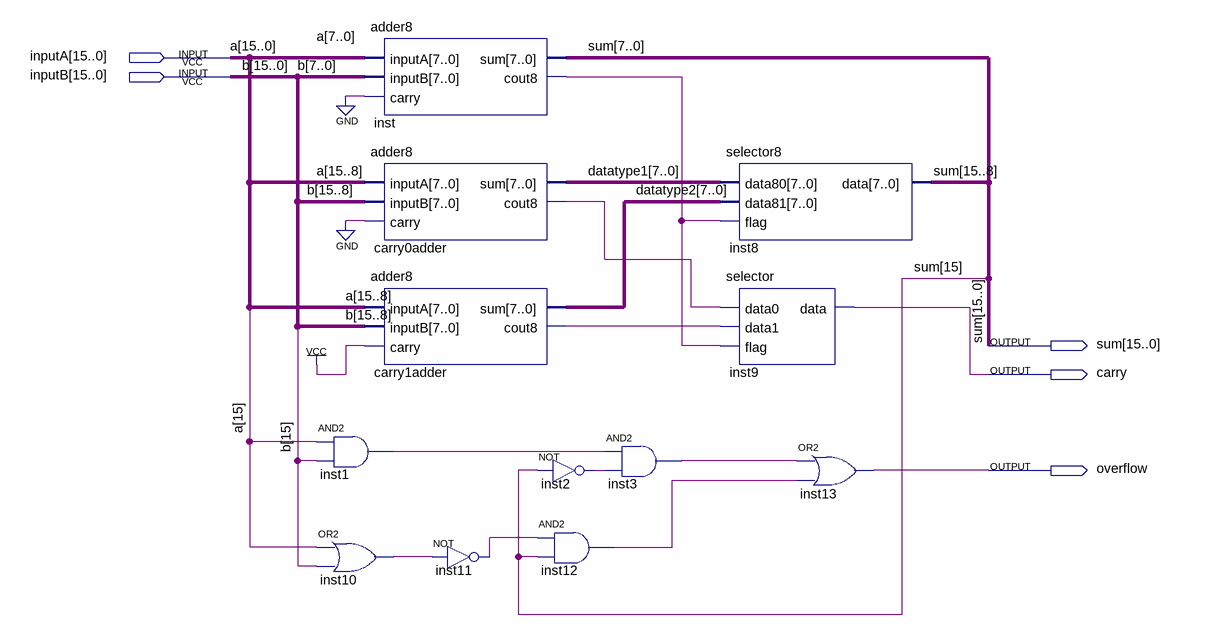
[diagram p0: schematic sheet]
// Quartus schematic adder16.bdf as structural Verilog: 12 symbols, 5 pins
module adder16 (
  input  [15:0] inputA,
  input  [15:0] inputB,
  output [15:0] sum,
  output carry,
  output overflow
);

  wire carry0adder_cout8, carry1adder_cout8, inst1_out, inst2_out, inst3_out, inst10_out, inst11_out,
       inst12_out, inst_cout8;
  wire [7:0] datatype1, datatype2;

  and inst1 (inst1_out, inputA[15], inputB[15]);
  or inst10 (inst10_out, inputA[15], inputB[15]);
  adder8 inst (.inputA(inputA[7:0]), .inputB(inputB[7:0]), .carry(1'b0), .sum(sum[7:0]), .cout8(inst_cout8));
  adder8 carry0adder (
    .inputA(inputA[15:8]), .inputB(inputB[15:8]), .carry(1'b0), .sum(datatype1), .cout8(carry0adder_cout8));
  adder8 carry1adder (
    .inputA(inputA[15:8]), .inputB(inputB[15:8]), .carry(1'b1), .sum(datatype2), .cout8(carry1adder_cout8));
  not inst11 (inst11_out, inst10_out);
  not inst2 (inst2_out, sum[15]);
  and inst12 (inst12_out, inst11_out, sum[15]);
  and inst3 (inst3_out, inst1_out, inst2_out);
  selector8 inst8 (.data80(datatype1), .data81(datatype2), .flag(inst_cout8), .data(sum[15:8]));
  selector inst9 (.data0(carry0adder_cout8), .data1(carry1adder_cout8), .flag(inst_cout8), .data(carry));
  or inst13 (overflow, inst3_out, inst12_out);

  // Other names for the same wires on the sheet: a[15:0] = inputA; b[15:0] = inputB
endmodule
